# Altium schematic sheet 2DDR3L_16bits.SchDoc: 2DDR3L_16bits
size A3; Date: Not used; ApprovedBy: Not used; CheckedBy: Not used; Author: Not used; CompanyName: STMicroelectronics; DrawnBy: Not used; Engineer: Not used; Organization: Not used; Address1: Not used; Address2: Not used; Address3: Not used; Address4: Not used; DocumentNumber: Not used; Revision: Not used; SheetNumber: 7; SheetTotal: 7; CurrentTime: Not used; CurrentDate: Not used; Time: Not used; DocumentFullPathAndName: Not used; DocumentName: Not used; ModifiedDate: Not used; ImagePath: Not used; Application_BuildNumber: Not used
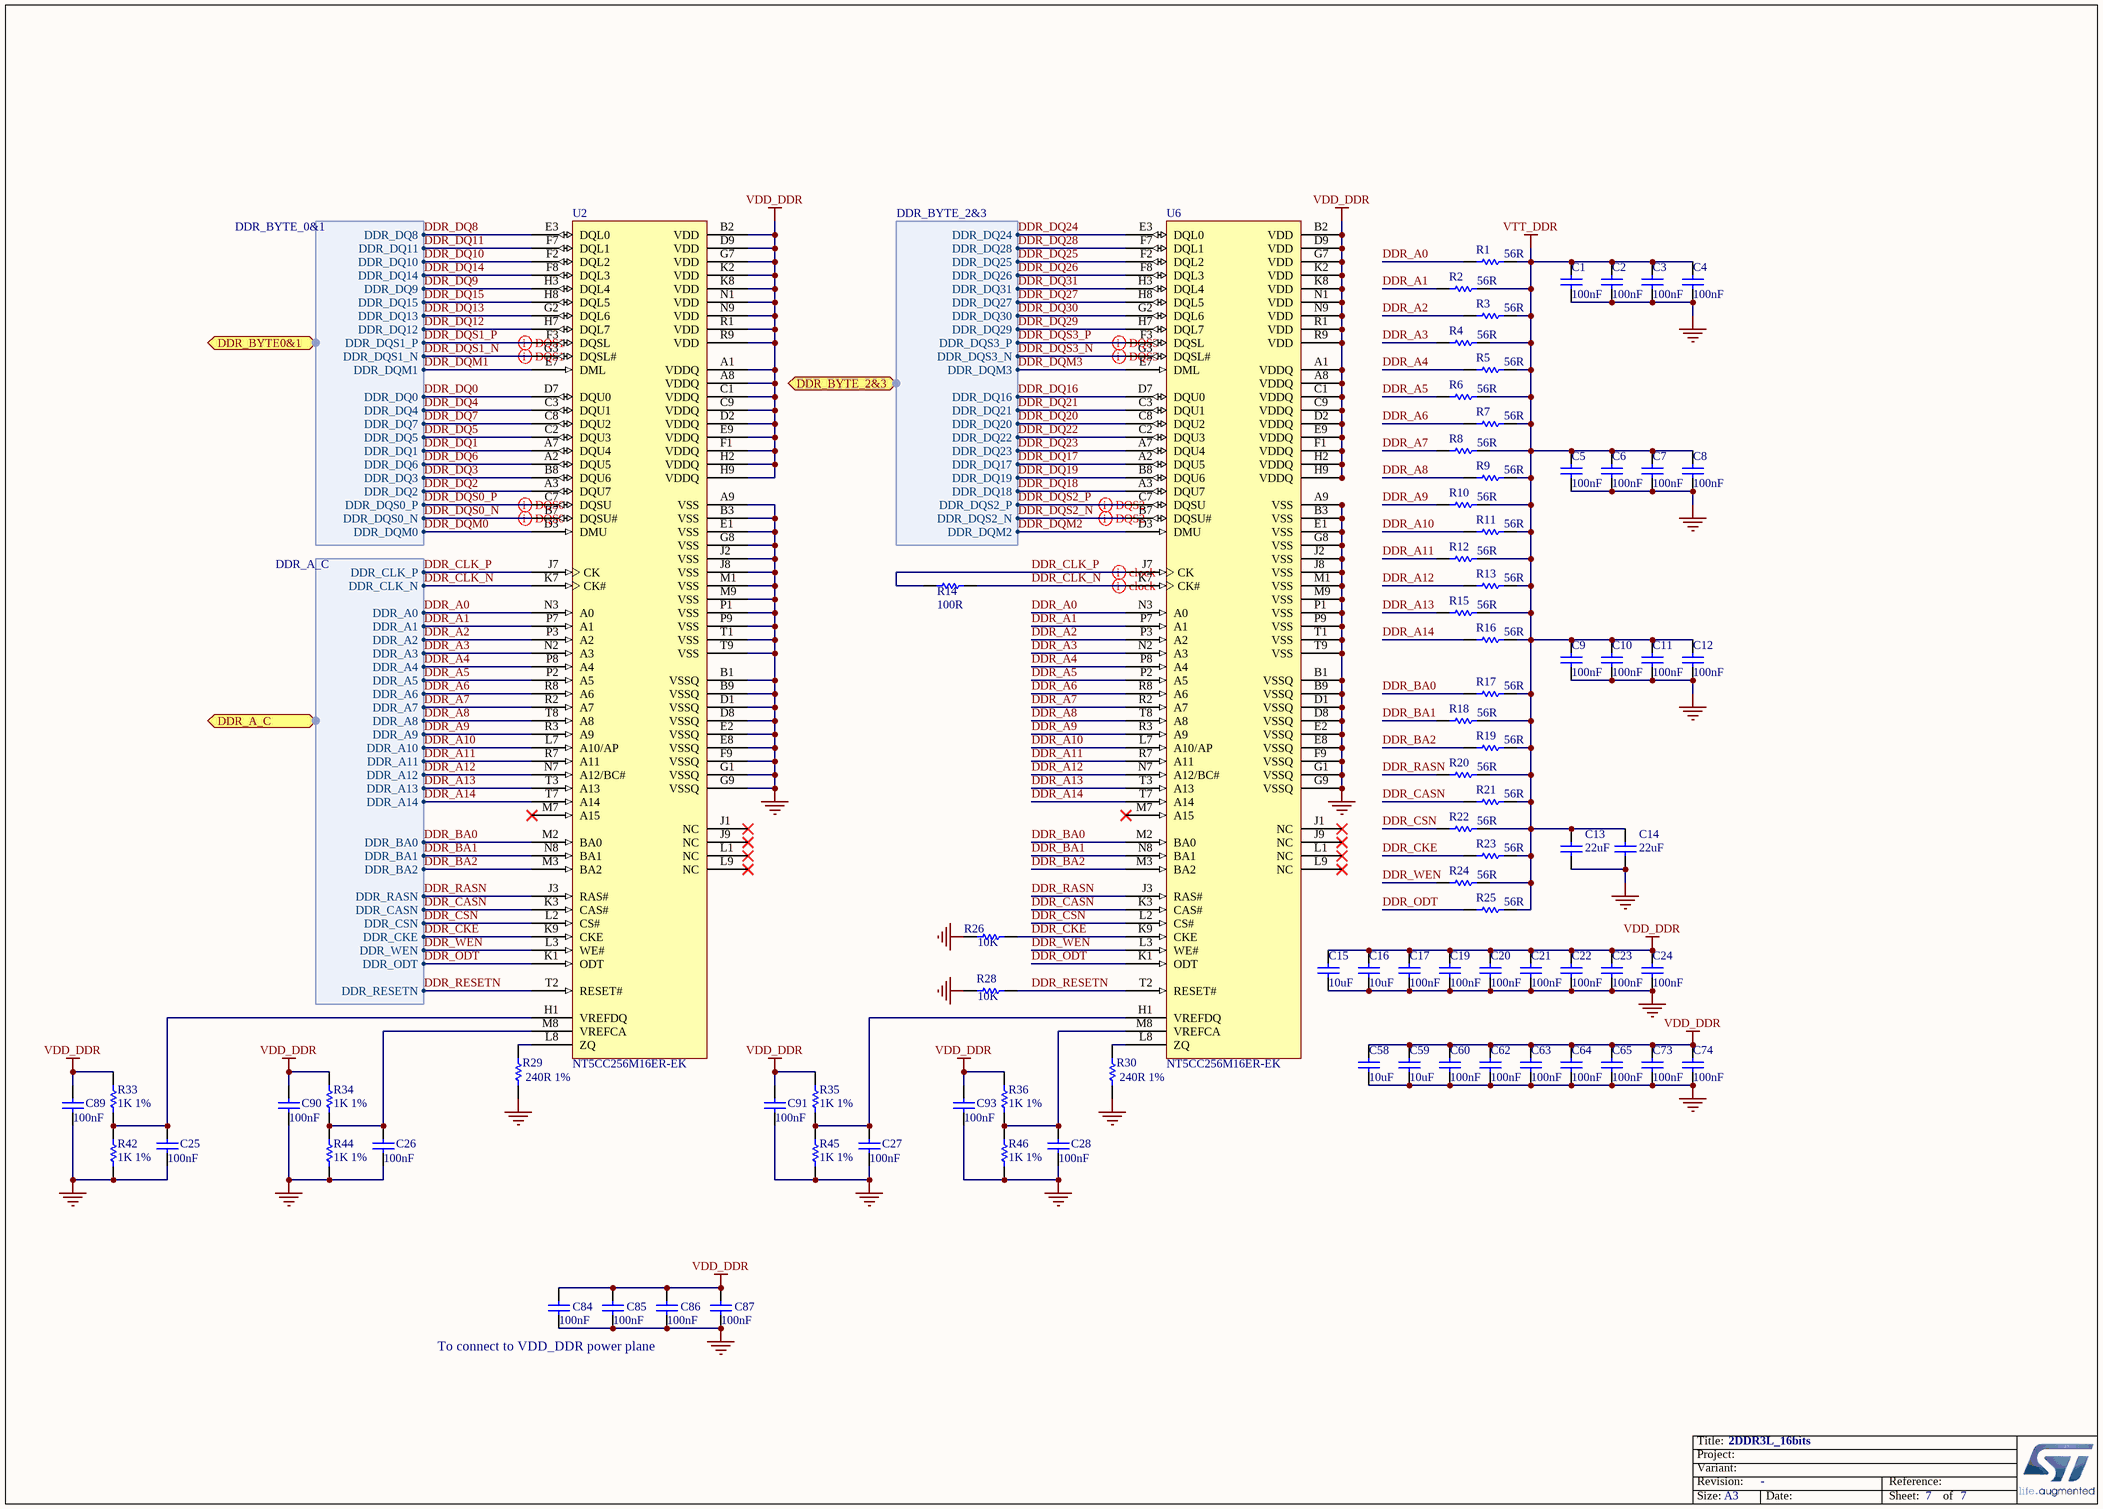
[diagram p0: 2DDR3L_16bits.SchDoc]

## Parts
C1  value 100nF  [C0402]
C2  value 100nF  [C0402]
C3  value 100nF  [C0402]
C4  value 100nF  [C0402]
C5  value 100nF  [C0402]
C6  value 100nF  [C0402]
C7  value 100nF  [C0402]
C8  value 100nF  [C0402]
C9  value 100nF  [C0402]
C10  value 100nF  [C0402]
C11  value 100nF  [C0402]
C12  value 100nF  [C0402]
C13  value 22uF  [C0603]
C14  value 22uF  [C0603]
C15  value 10uF  [C0603]
C16  value 10uF  [C0603]
C17  value 100nF  [C0402]
C19  value 100nF  [C0402]
C20  value 100nF  [C0402]
C21  value 100nF  [C0402]
C22  value 100nF  [C0402]
C23  value 100nF  [C0402]
C24  value 100nF  [C0402]
C25  value 100nF  [C0402]
C26  value 100nF  [C0402]
C27  value 100nF  [C0402]
C28  value 100nF  [C0402]
C58  value 10uF  [C0603]
C59  value 10uF  [C0603]
C60  value 100nF  [C0402]
C62  value 100nF  [C0402]
C63  value 100nF  [C0402]
C64  value 100nF  [C0402]
C65  value 100nF  [C0402]
C73  value 100nF  [C0402]
C74  value 100nF  [C0402]
C84  value 100nF  [C0402]
C85  value 100nF  [C0402]
C86  value 100nF  [C0402]
C87  value 100nF  [C0402]
C89  value 100nF  [C0402]
C90  value 100nF  [C0402]
C91  value 100nF  [C0402]
C93  value 100nF  [C0402]
R1  value 56R  [R0402]
R2  value 56R  [R0402]
R3  value 56R  [R0402]
R4  value 56R  [R0402]
R5  value 56R  [R0402]
R6  value 56R  [R0402]
R7  value 56R  [R0402]
R8  value 56R  [R0402]
R9  value 56R  [R0402]
R10  value 56R  [R0402]
R11  value 56R  [R0402]
R12  value 56R  [R0402]
R13  value 56R  [R0402]
R14  value 100R  [R0402]
R15  value 56R  [R0402]
R16  value 56R  [R0402]
R17  value 56R  [R0402]
R18  value 56R  [R0402]
R19  value 56R  [R0402]
R20  value 56R  [R0402]
R21  value 56R  [R0402]
R22  value 56R  [R0402]
R23  value 56R  [R0402]
R24  value 56R  [R0402]
R25  value 56R  [R0402]
R26  value 10K  [R0402]
R28  value 10K  [R0402]
R29  value 240R 1%  [R0402]
R30  value 240R 1%  [R0402]
R33  value 1K 1%  [R0402]  (hidden comment: Resistor)
R34  value 1K 1%  [R0402]  (hidden comment: Resistor)
R35  value 1K 1%  [R0402]  (hidden comment: Resistor)
R36  value 1K 1%  [R0402]  (hidden comment: Resistor)
R42  value 1K 1%  [R0402]  (hidden comment: Resistor)
R44  value 1K 1%  [R0402]  (hidden comment: Resistor)
R45  value 1K 1%  [R0402]  (hidden comment: Resistor)
R46  value 1K 1%  [R0402]  (hidden comment: Resistor)
U2  NT5CC256M16ER-EK  [ICC_VFBGA96_9x13_P080]
U6  NT5CC256M16ER-EK  [ICC_VFBGA96_9x13_P080]

## Ports
DDR_A_C (harness DDR_A_C), DDR_BYTE0&1 (harness DDR_BYTE_0&1), DDR_BYTE_2&3 (harness DDR_BYTE_2&3)

## Harnesses
DDR_A_C: DDR_A4, DDR_A0, DDR_A2, DDR_A1, DDR_A6, DDR_A3, DDR_A5, DDR_A7, DDR_A8, DDR_A9, DDR_A14, DDR_A10, DDR_A12, DDR_A11, DDR_BA0, DDR_A13, DDR_BA1, DDR_BA2, DDR_RASN, DDR_CASN, DDR_CSN, DDR_CKE, DDR_WEN, DDR_ODT, DDR_CLK_P, DDR_CLK_N, DDR_RESETN
DDR_BYTE_0&1: DDR_DQ9, DDR_DQ8, DDR_DQ10, DDR_DQ11, DDR_DQ13, DDR_DQ14, DDR_DQ15, DDR_DQ12, DDR_DQS1_P, DDR_DQS1_N, DDR_DQ7, DDR_DQM1, DDR_DQ0, DDR_DQ1, DDR_DQ4, DDR_DQ5, DDR_DQ6, DDR_DQ3, DDR_DQ2, DDR_DQS0_P, DDR_DQS0_N, DDR_DQM0
DDR_BYTE_2&3: DDR_DQ24, DDR_DQ28, DDR_DQ25, DDR_DQ26, DDR_DQ31, DDR_DQ27, DDR_DQ30, DDR_DQ29, DDR_DQS3_P, DDR_DQS3_N, DDR_DQM3, DDR_DQ16, DDR_DQ21, DDR_DQ20, DDR_DQ22, DDR_DQ23, DDR_DQ17, DDR_DQ19, DDR_DQ18, DDR_DQS2_P, DDR_DQS2_N, DDR_DQM2

## Nets
GND: C1.2 C2.2 C3.2 C4.2 C5.2 C6.2 C7.2 C8.2 C9.2 C10.2 C11.2 C12.2 C13.1 C14.1 C15.1 C16.1 C17.2 C19.2 C20.2 C21.2 C22.2 C23.2 C24.2 C25.2 C26.2 C27.2 C28.2 C58.1 C59.1 C60.2 C62.2 C63.2 C64.2 C65.2 C73.2 C74.2 C84.2 C85.2 C86.2 C87.2 C89.2 C90.2 C91.2 C93.2 R26.1 R28.1 R29.1 R30.1 R42.1 R44.1 R45.1 R46.1 U2.A9(VSS) U2.B1(VSSQ) U2.B3(VSS) U2.B9(VSSQ) U2.D1(VSSQ) U2.D8(VSSQ) U2.E1(VSS) U2.E2(VSSQ) U2.E8(VSSQ) U2.F9(VSSQ) U2.G1(VSSQ) U2.G8(VSS) U2.G9(VSSQ) U2.J2(VSS) U2.J8(VSS) U2.M1(VSS) U2.M9(VSS) U2.P1(VSS) U2.P9(VSS) U2.T1(VSS) U2.T9(VSS) U6.A9(VSS) U6.B1(VSSQ) U6.B3(VSS) U6.B9(VSSQ) U6.D1(VSSQ) U6.D8(VSSQ) U6.E1(VSS) U6.E2(VSSQ) U6.E8(VSSQ) U6.F9(VSSQ) U6.G1(VSSQ) U6.G8(VSS) U6.G9(VSSQ) U6.J2(VSS) U6.J8(VSS) U6.M1(VSS) U6.M9(VSS) U6.P1(VSS) U6.P9(VSS) U6.T1(VSS) U6.T9(VSS)
VDD_DDR: C15.2 C16.2 C17.1 C19.1 C20.1 C21.1 C22.1 C23.1 C24.1 C58.2 C59.2 C60.1 C62.1 C63.1 C64.1 C65.1 C73.1 C74.1 C84.1 C85.1 C86.1 C87.1 C89.1 C90.1 C91.1 C93.1 R33.2 R34.2 R35.2 R36.2 U2.A1(VDDQ) U2.A8(VDDQ) U2.B2(VDD) U2.C1(VDDQ) U2.C9(VDDQ) U2.D2(VDDQ) U2.D9(VDD) U2.E9(VDDQ) U2.F1(VDDQ) U2.G7(VDD) U2.H2(VDDQ) U2.H9(VDDQ) U2.K2(VDD) U2.K8(VDD) U2.N1(VDD) U2.N9(VDD) U2.R1(VDD) U2.R9(VDD) U6.A1(VDDQ) U6.A8(VDDQ) U6.B2(VDD) U6.C1(VDDQ) U6.C9(VDDQ) U6.D2(VDDQ) U6.D9(VDD) U6.E9(VDDQ) U6.F1(VDDQ) U6.G7(VDD) U6.H2(VDDQ) U6.H9(VDDQ) U6.K2(VDD) U6.K8(VDD) U6.N1(VDD) U6.N9(VDD) U6.R1(VDD) U6.R9(VDD)
VTT_DDR: C1.1 C2.1 C3.1 C4.1 C5.1 C6.1 C7.1 C8.1 C9.1 C10.1 C11.1 C12.1 C13.2 C14.2 R1.2 R2.2 R3.2 R4.2 R5.2 R6.2 R7.2 R8.2 R9.2 R10.2 R11.2 R12.2 R13.2 R15.2 R16.2 R17.2 R18.2 R19.2 R20.2 R21.2 R22.2 R23.2 R24.2 R25.2
DDR_A0: R1.1 U2.N3(A0) U6.N3(A0) ; port DDR_A_C.DDR_A0
DDR_A1: R2.1 U2.P7(A1) U6.P7(A1) ; port DDR_A_C.DDR_A1
DDR_A2: R3.1 U2.P3(A2) U6.P3(A2) ; port DDR_A_C.DDR_A2
DDR_A3: R4.1 U2.N2(A3) U6.N2(A3) ; port DDR_A_C.DDR_A3
DDR_A4: R5.1 U2.P8(A4) U6.P8(A4) ; port DDR_A_C.DDR_A4
DDR_A5: R6.1 U2.P2(A5) U6.P2(A5) ; port DDR_A_C.DDR_A5
DDR_A6: R7.1 U2.R8(A6) U6.R8(A6) ; port DDR_A_C.DDR_A6
DDR_A7: R8.1 U2.R2(A7) U6.R2(A7) ; port DDR_A_C.DDR_A7
DDR_A8: R9.1 U2.T8(A8) U6.T8(A8) ; port DDR_A_C.DDR_A8
DDR_A9: R10.1 U2.R3(A9) U6.R3(A9) ; port DDR_A_C.DDR_A9
DDR_A10: R11.1 U2.L7(A10/AP) U6.L7(A10/AP) ; port DDR_A_C.DDR_A10
DDR_A11: R12.1 U2.R7(A11) U6.R7(A11) ; port DDR_A_C.DDR_A11
DDR_A12: R13.1 U2.N7(A12/BC#) U6.N7(A12/BC#) ; port DDR_A_C.DDR_A12
DDR_A13: R15.1 U2.T3(A13) U6.T3(A13) ; port DDR_A_C.DDR_A13
DDR_A14: R16.1 U2.T7(A14) U6.T7(A14) ; port DDR_A_C.DDR_A14
DDR_BA0: R17.1 U2.M2(BA0) U6.M2(BA0) ; port DDR_A_C.DDR_BA0
DDR_BA1: R18.1 U2.N8(BA1) U6.N8(BA1) ; port DDR_A_C.DDR_BA1
DDR_BA2: R19.1 U2.M3(BA2) U6.M3(BA2) ; port DDR_A_C.DDR_BA2
DDR_CASN: R21.1 U2.K3(CAS#) U6.K3(CAS#) ; port DDR_A_C.DDR_CASN
DDR_CKE: R23.1 R26.2 U2.K9(CKE) U6.K9(CKE) ; port DDR_A_C.DDR_CKE
DDR_CLK_N: R14.2 U2.K7(CK#) U6.K7(CK#) ; port DDR_A_C.DDR_CLK_N
DDR_CLK_P: R14.1 U2.J7(CK) U6.J7(CK) ; port DDR_A_C.DDR_CLK_P
DDR_CSN: R22.1 U2.L2(CS#) U6.L2(CS#) ; port DDR_A_C.DDR_CSN
DDR_DQ0: U2.D7(DQU0) ; port DDR_BYTE0&1.DDR_DQ0
DDR_DQ1: U2.A7(DQU4) ; port DDR_BYTE0&1.DDR_DQ1
DDR_DQ2: U2.A3(DQU7) ; port DDR_BYTE0&1.DDR_DQ2
DDR_DQ3: U2.B8(DQU6) ; port DDR_BYTE0&1.DDR_DQ3
DDR_DQ4: U2.C3(DQU1) ; port DDR_BYTE0&1.DDR_DQ4
DDR_DQ5: U2.C2(DQU3) ; port DDR_BYTE0&1.DDR_DQ5
DDR_DQ6: U2.A2(DQU5) ; port DDR_BYTE0&1.DDR_DQ6
DDR_DQ7: U2.C8(DQU2) ; port DDR_BYTE0&1.DDR_DQ7
DDR_DQ8: U2.E3(DQL0) ; port DDR_BYTE0&1.DDR_DQ8
DDR_DQ9: U2.H3(DQL4) ; port DDR_BYTE0&1.DDR_DQ9
DDR_DQ10: U2.F2(DQL2) ; port DDR_BYTE0&1.DDR_DQ10
DDR_DQ11: U2.F7(DQL1) ; port DDR_BYTE0&1.DDR_DQ11
DDR_DQ12: U2.H7(DQL7) ; port DDR_BYTE0&1.DDR_DQ12
DDR_DQ13: U2.G2(DQL6) ; port DDR_BYTE0&1.DDR_DQ13
DDR_DQ14: U2.F8(DQL3) ; port DDR_BYTE0&1.DDR_DQ14
DDR_DQ15: U2.H8(DQL5) ; port DDR_BYTE0&1.DDR_DQ15
DDR_DQ16: U6.D7(DQU0) ; port DDR_BYTE_2&3.DDR_DQ16
DDR_DQ17: U6.A2(DQU5) ; port DDR_BYTE_2&3.DDR_DQ17
DDR_DQ18: U6.A3(DQU7) ; port DDR_BYTE_2&3.DDR_DQ18
DDR_DQ19: U6.B8(DQU6) ; port DDR_BYTE_2&3.DDR_DQ19
DDR_DQ20: U6.C8(DQU2) ; port DDR_BYTE_2&3.DDR_DQ20
DDR_DQ21: U6.C3(DQU1) ; port DDR_BYTE_2&3.DDR_DQ21
DDR_DQ22: U6.C2(DQU3) ; port DDR_BYTE_2&3.DDR_DQ22
DDR_DQ23: U6.A7(DQU4) ; port DDR_BYTE_2&3.DDR_DQ23
DDR_DQ24: U6.E3(DQL0) ; port DDR_BYTE_2&3.DDR_DQ24
DDR_DQ25: U6.F2(DQL2) ; port DDR_BYTE_2&3.DDR_DQ25
DDR_DQ26: U6.F8(DQL3) ; port DDR_BYTE_2&3.DDR_DQ26
DDR_DQ27: U6.H8(DQL5) ; port DDR_BYTE_2&3.DDR_DQ27
DDR_DQ28: U6.F7(DQL1) ; port DDR_BYTE_2&3.DDR_DQ28
DDR_DQ29: U6.H7(DQL7) ; port DDR_BYTE_2&3.DDR_DQ29
DDR_DQ30: U6.G2(DQL6) ; port DDR_BYTE_2&3.DDR_DQ30
DDR_DQ31: U6.H3(DQL4) ; port DDR_BYTE_2&3.DDR_DQ31
DDR_DQM0: U2.D3(DMU) ; port DDR_BYTE0&1.DDR_DQM0
DDR_DQM1: U2.E7(DML) ; port DDR_BYTE0&1.DDR_DQM1
DDR_DQM2: U6.D3(DMU) ; port DDR_BYTE_2&3.DDR_DQM2
DDR_DQM3: U6.E7(DML) ; port DDR_BYTE_2&3.DDR_DQM3
DDR_DQS0_N: U2.B7(DQSU#) ; port DDR_BYTE0&1.DDR_DQS0_N
DDR_DQS0_P: U2.C7(DQSU) ; port DDR_BYTE0&1.DDR_DQS0_P
DDR_DQS1_N: U2.G3(DQSL#) ; port DDR_BYTE0&1.DDR_DQS1_N
DDR_DQS1_P: U2.F3(DQSL) ; port DDR_BYTE0&1.DDR_DQS1_P
DDR_DQS2_N: U6.B7(DQSU#) ; port DDR_BYTE_2&3.DDR_DQS2_N
DDR_DQS2_P: U6.C7(DQSU) ; port DDR_BYTE_2&3.DDR_DQS2_P
DDR_DQS3_N: U6.G3(DQSL#) ; port DDR_BYTE_2&3.DDR_DQS3_N
DDR_DQS3_P: U6.F3(DQSL) ; port DDR_BYTE_2&3.DDR_DQS3_P
DDR_ODT: R25.1 U2.K1(ODT) U6.K1(ODT) ; port DDR_A_C.DDR_ODT
DDR_RASN: R20.1 U2.J3(RAS#) U6.J3(RAS#) ; port DDR_A_C.DDR_RASN
DDR_RESETN: R28.2 U2.T2(RESET#) U6.T2(RESET#) ; port DDR_A_C.DDR_RESETN
DDR_WEN: R24.1 U2.L3(WE#) U6.L3(WE#) ; port DDR_A_C.DDR_WEN
NetC25_1: C25.1 R33.1 R42.2 U2.H1(VREFDQ)
NetC26_1: C26.1 R34.1 R44.2 U2.M8(VREFCA)
NetC27_1: C27.1 R35.1 R45.2 U6.H1(VREFDQ)
NetC28_1: C28.1 R36.1 R46.2 U6.M8(VREFCA)
NetR29_2: R29.2 U2.L8(ZQ)
NetR30_2: R30.2 U6.L8(ZQ)

Not connected (* = marked no-connect by the designer): U2 J1(NC)* J9(NC)* L1(NC)* L9(NC)* M7(A15)*; U6 J1(NC)* J9(NC)* L1(NC)* L9(NC)* M7(A15)*

## Layout directives
differential pair: DDR_CLK_N, DDR_CLK_P, DDR_DQS0_N, DDR_DQS0_P, DDR_DQS1_N, DDR_DQS1_P, DDR_DQS2_N, DDR_DQS2_P, DDR_DQS3_N, DDR_DQS3_P

## Notes on the sheet
- To connect to VDD_DDR power plane
- Title:
- Project:
- Size:
- Revision:
- Variant:
- A3
- -
- Date:
- Reference:
- Sheet:
- of

## Library data of the parts
C1-C12 C17 C19-C28 C60 C62-C65 C73 C74 C84-C87 C89-C91 C93 = MCD-00006: Capacitor, MLCC, 100nF, 16V, X7R, 10%, 0402, T=0.5mm; Manufacturer_Part_Number: CC0402KRX7R7BB104; Manufacturer: YAGEO; Alternate_Manufacturer_Part_Number: GCM155R71C104KA55D; Alternate_Manufacturer: MURATA; Provided_By: SUBCO; Internal_Part_Number: MCD-00006; Status: Released; Part_Type: Capacitor; Package: C0402; ComponentLink1Description: Datasheet; ComponentLink1URL: http://tunmcdsvn.tun.st.com/Component_Datasheet_Library/Trunk/Capacitors/Yageo_Multilayer_Capacitor_X7R_series_100pF_to_22uF
C13 C14 = MCD-00100: Capacitor, MLCC, 22uF, 6V3, X5R, 20%, 0603, T=0,8mm; Manufacturer_Part_Number: GRM188R60J226MEA0J; Manufacturer: MURATA; Provided_By: SUBCO; Internal_Part_Number: MCD-00100; Status: Released; Part_Type: Capacitor; Package: C0603; ComponentLink1Description: Datasheet; ComponentLink1URL: http://tunmcdsvn.tun.st.com/Component_Datasheet_Library/Trunk/Capacitors/Murata_Capacitor_GR_series
C15 C16 C58 C59 = MCD-01124: Capacitor, MLCC, 10µF, 10V, X5R, 10%, 0603, T=0.8mm; Manufacturer_Part_Number: GRM188R61A106KAAL; Manufacturer: MURATA; Provided_By: SUBCO; Internal_Part_Number: MCD-01124; Status: Released; Part_Type: Capacitor; Package: C0603; ComponentLink1Description: Datasheet; ComponentLink1URL: http://tunmcdsvn.tun.st.com/Component_Datasheet_Library/Trunk/Capacitors/Murata_Capacitor_GR_series
R1-R13 R15-R25 = MCD-00054: Resistor,56R,0402,1%,1/16W; Manufacturer_Part_Number: RC0402FR-0756RL; Manufacturer: YAGEO; Provided_By: SUBCO; Internal_Part_Number: MCD-00054; Status: Released; Part_Type: Resistor; Package: R0402; ComponentLink1Description: Datasheet; ComponentLink1URL: http://tunmcdsvn.tun.st.com/Component_Datasheet_Library/Trunk/Resistors/Yageo_Resistor_RC0402-series
R14 = MCD-00067: Resistor,100R,0402,1%,1/16W; Manufacturer_Part_Number: RC0402FR-07100RL; Manufacturer: YAGEO; Provided_By: SUBCO; Internal_Part_Number: MCD-00067; Status: Released; Part_Type: Resistor; Package: R0402; ComponentLink1Description: Datasheet; ComponentLink1URL: http://tunmcdsvn.tun.st.com/Component_Datasheet_Library/Trunk/Resistors/Yageo_Resistor_RC0402-series
R26 R28 = MCD-00053: Resistor,10K,0402,1%,1/16W; Manufacturer_Part_Number: RC0402FR-0710KL; Manufacturer: YAGEO; Provided_By: SUBCO; Internal_Part_Number: MCD-00053; Status: Released; Part_Type: Resistor; Package: R0402; ComponentLink1Description: Datasheet; ComponentLink1URL: http://tunmcdsvn.tun.st.com/Component_Datasheet_Library/Trunk/Resistors/Yageo_Resistor_RC0402-series
R29 R30 = MCD-00120: Resistor,240R,0402,1%,1/16W; Manufacturer_Part_Number: RC0402FR-07240RL; Manufacturer: YAGEO; Provided_By: SUBCO; Internal_Part_Number: MCD-00120; Status: Released; Part_Type: Resistor; Package: R0402; ComponentLink1Description: Datasheet; ComponentLink1URL: http://tunmcdsvn.tun.st.com/Component_Datasheet_Library/Trunk/Resistors/Yageo_Resistor_RC0402-series
R33-R36 R42 R44-R46 = MCD-00061: Resistor,1K,0402,1%,1/16W; Manufacturer_Part_Number: RC0402FR-071KL; Manufacturer: YAGEO; Provided_By: SUBCO; Internal_Part_Number: MCD-00061; Status: Released; Part_Type: Resistor; Package: R0402; ComponentLink1Description: Datasheet; ComponentLink1URL: http://tunmcdsvn.tun.st.com/Component_Datasheet_Library/Trunk/Resistors/Yageo_Resistor_RC0402-series
U2 U6 = MCD-01811: Memory,DDR3L,4Gb,256Mbx16,933Mhz,1V35,TFBGA; Part_Type: IC; Manufacturer: NANYA; BMS_Part_Number: 9171435; ECCN_US: tbd; Provided_By: SUBCO; Internal_Part_Number: MCD-01811; Value: NT5CC256M16ER-EK; Status: Released; Manufacturer_Part_Number: NT5CC256M16ER-EK; ComponentLink1Description: Datasheet; ComponentLink1URL: http://tunmcdsvn.tun.st.com/Component_Datasheet_Library/Trunk/IC/Nanya_DDR3_NT5CC256M16ER-EK; ECCN_EU: tbd